# EAGLE design motordriver (EAGLE 6.4)
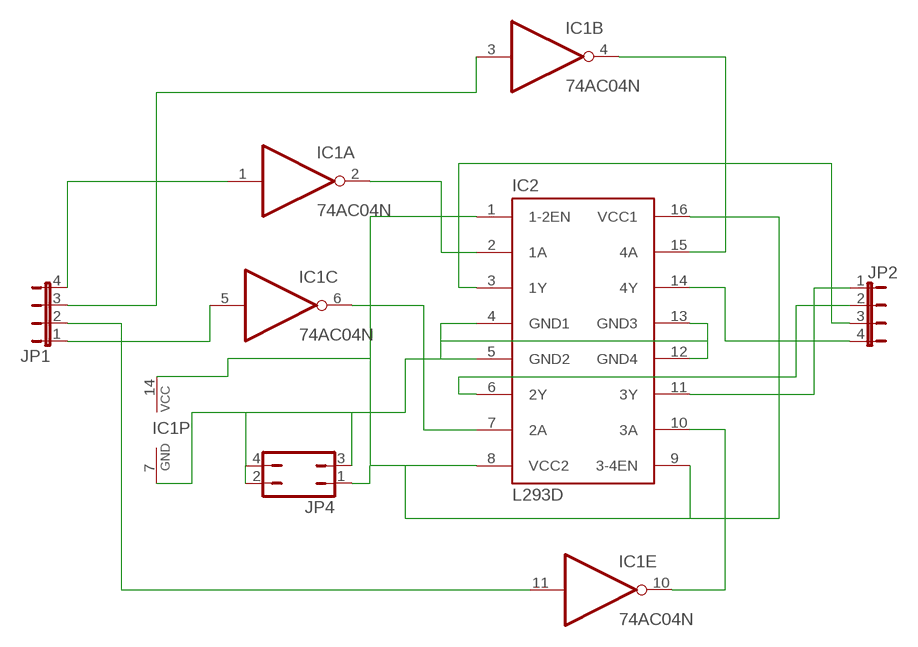
[diagram p0: schematic, sheet 1]

## Parts
IC1  74AC04N  [DIL14]
IC2  L293D  [DIL16]
JP1  JP4E  [JP4]
JP2  JP4E  [JP4]
JP4  JP2Q  [JP2Q]

## Nets
N$1: IC1.1(A:I) JP1.4
N$2: IC1.5(C:I) JP1.1
N$3: IC1.3(B:I) JP1.3
N$5: IC1.2(A:O) IC2.2(1A)
N$6: IC1.6(C:O) IC2.7(2A)
N$7: IC1.4(B:O) IC2.15(4A)
N$8: IC1.10(E:O) IC2.10(3A)
N$9: IC2.3(1Y) JP2.3
N$10: IC2.6(2Y) JP2.2
N$11: IC2.11(3Y) JP2.1
N$12: IC2.14(4Y) JP2.4
N$14: IC1.11(E:I) JP1.2
N$15: IC1.14(P:VCC) IC2.1(1-2EN) IC2.8(VCC2) IC2.9(3-4EN) IC2.16(VCC1) JP4.1
N$17: IC1.7(P:GND) IC2.4(GND1) IC2.5(GND2) IC2.12(GND4) IC2.13(GND3) JP4.2 JP4.3 JP4.4
Unconnected: IC1.8(D:O) IC1.9(D:I) IC1.12(F:O) IC1.13(F:I)

## Library data of the parts
IC1 = 74xx-eu:74*04: Hex INVERTER
IC2 = st-microelectronics:L293D: PUSH-PULL 4 CHANNEL DRIVER; MPN: L293D; OC_FARNELL: 9589619; OC_NEWARK: 56P8249
JP1 JP2 = jumper:JP4E: JUMPER
JP4 = jumper:JP2Q: JUMPER

## Board
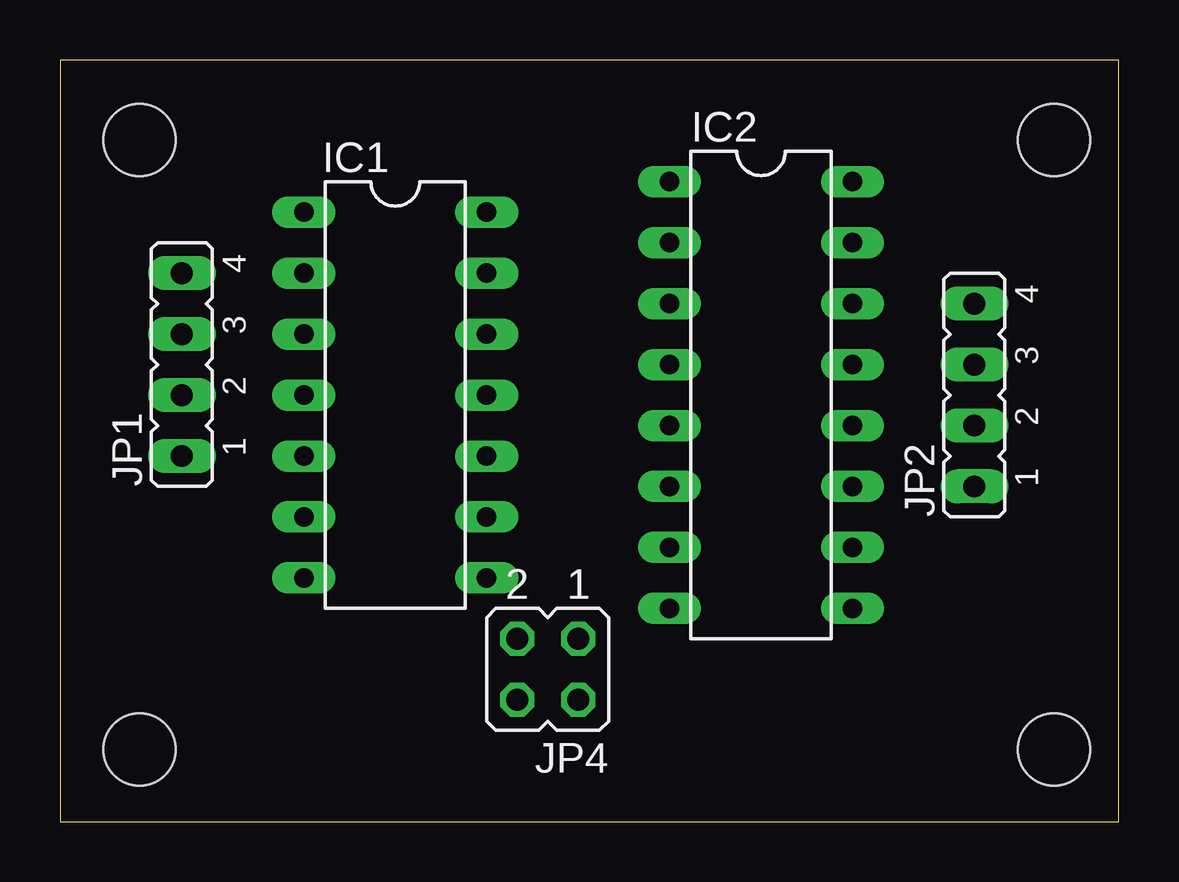
[diagram p1: board, top side]
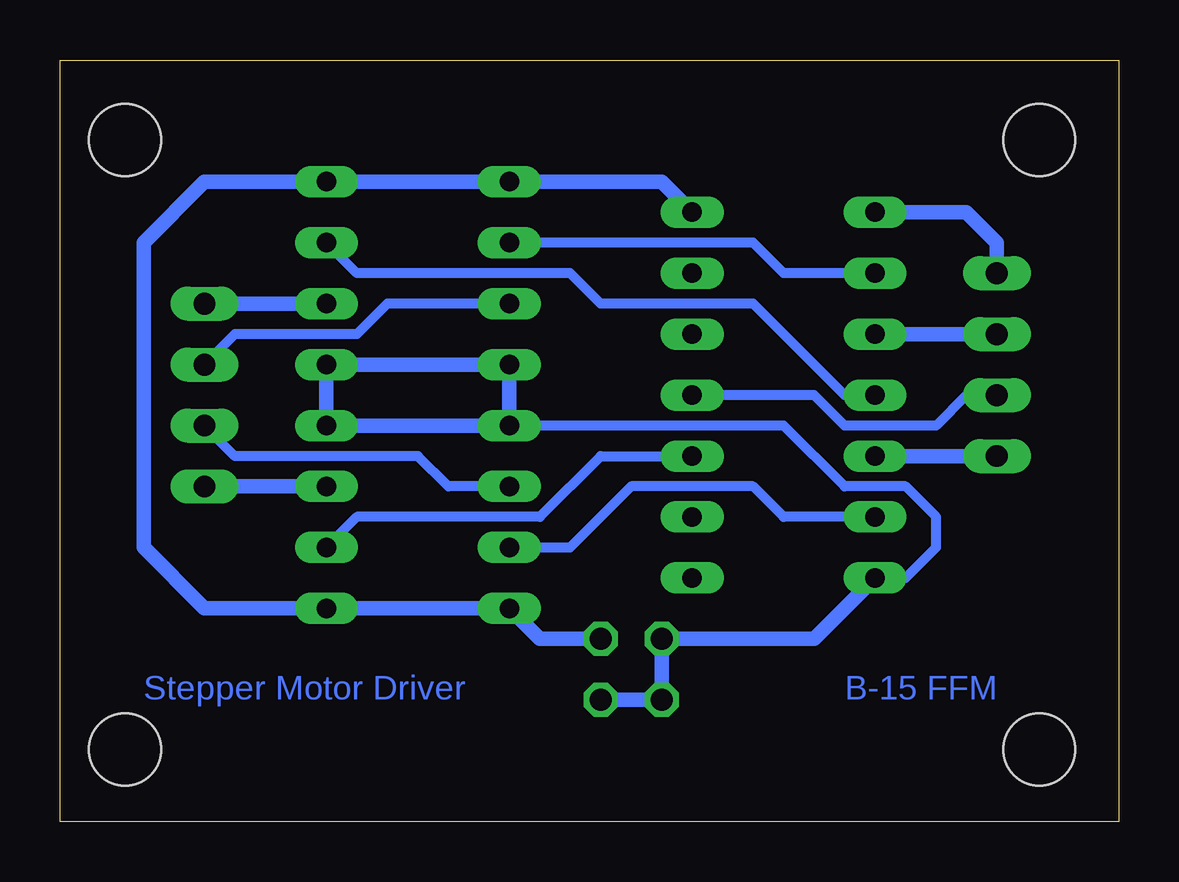
[diagram p2: board, bottom side, seen from below]

Size 44.12 x 31.74 mm. Coordinates in mm from the lower left corner, seen from the top.
Outline: 0,0 44.12,0 44.12,31.74 0,31.74 0,0
Copper layers (1*16): Top 0.035mm / dielectric 1.5mm / Bottom 0.035mm
Design rules "default *": minimum track width 16mil, minimum drill 30mil, track to track 16mil, track to pad 16mil, pad to pad 16mil, via to via 16mil, smd to smd 16mil, copper to edge 40mil, drill to drill 8mil, minimum pad ring 10mil, minimum via ring 8mil, stop-mask expansion 4mil, vias tented up to drill 0mil, thermal gap 10mil
Holes 3 mm at 3.32,28.41 41.42,28.41 41.42,3.01 3.32,3.01

### Footprints (pad centres in the part's own frame; a part is rotated, then mirrored left to right if it is on the bottom)
DIL14 = drill 0.813 long: 1 -7.62,-3.81; 2 -5.08,-3.81; 3 -2.54,-3.81; 4 0,-3.81; 5 2.54,-3.81; 6 5.08,-3.81; 7 7.62,-3.81; 8 7.62,3.81; 9 5.08,3.81; 10 2.54,3.81; 11 0,3.81; 12 -2.54,3.81; 13 -5.08,3.81; 14 -7.62,3.81
DIL16 = drill 0.813 long: 1 -8.89,-3.81; 2 -6.35,-3.81; 3 -3.81,-3.81; 4 -1.27,-3.81; 5 1.27,-3.81; 6 3.81,-3.81; 7 6.35,-3.81; 8 8.89,-3.81; 9 8.89,3.81; 10 6.35,3.81; 11 3.81,3.81; 12 1.27,3.81; 13 -1.27,3.81; 14 -3.81,3.81; 15 -6.35,3.81; 16 -8.89,3.81
JP4 = drill 0.914 long: 1 -3.81,0; 2 -1.27,0; 3 1.27,0; 4 3.81,0
JP2Q = drill 0.914 octagon: 1 -1.27,-1.27; 2 1.27,-1.27; 3 -1.27,1.27; 4 1.27,1.27

### Placement (x,y rotation side)
IC1  13.97,17.78 270 top
IC2  29.21,17.78 270 top
JP1  5.08,19.05 90 top
JP2  38.1,17.78 90 top
JP4  20.32,6.35 180 top

### Tracks (layer width: path | path; a pad name or v marks a point on that pad's centre or on a via)
N$1
  Bottom 0.61: JP1.4 5.08,24.13 6.35,25.4 IC1.1
N$2
  Bottom 0.61: JP1.1 IC1.5
N$3
  Bottom 0.61: JP1.3 IC1.3
N$5
  Bottom 0.406: IC2.2 15.24,24.13 13.97,22.86 IC1.2
N$6
  Bottom 0.406: IC1.6 13.97,12.7 15.24,13.97 20.32,13.97 22.86,11.43 IC2.7
N$7
  Bottom 0.406: IC1.4 11.43,17.78 15.24,21.59 21.59,21.59 22.86,22.86 31.75,22.86 IC2.15
N$8
  Bottom 0.406: IC2.10 31.75,12.7 24.13,12.7 21.59,15.24 IC1.10
N$9
  Bottom 0.406: IC2.3 30.48,21.59 31.75,20.32 36.83,20.32 JP2.3
N$10
  Bottom 0.406: IC2.6 27.94,13.97 29.21,15.24 36.83,15.24 JP2.2
N$11
  Bottom 0.61: IC2.11 JP2.1
N$12
  Bottom 0.61: IC2.14 JP2.4
N$14
  Bottom 0.406: JP1.2 6.35,17.78 7.62,16.51 11.43,16.51 12.7,17.78 IC1.11
N$15
  Bottom 0.61: JP4.1 24.13,7.62 IC2.8 IC2.9 38.1,8.89 40.64,11.43 40.64,24.13 38.1,26.67 IC2.16 IC2.1 19.05,26.67 IC1.14
N$17
  Bottom 0.406: IC2.5 13.97,16.51 11.43,13.97 8.89,13.97 7.62,12.7 7.62,11.43 8.89,10.16 IC1.7
  Bottom 0.61: JP4.3 JP4.4 JP4.2 12.7,7.62 IC1.7 | IC2.4 IC2.13 IC2.12 IC2.5 IC2.4

### Text on the board
Bottom: B-15 FFM | Stepper Motor Driver